# Altium project AIRZAI_LID_BD_REVB.PrjPcb
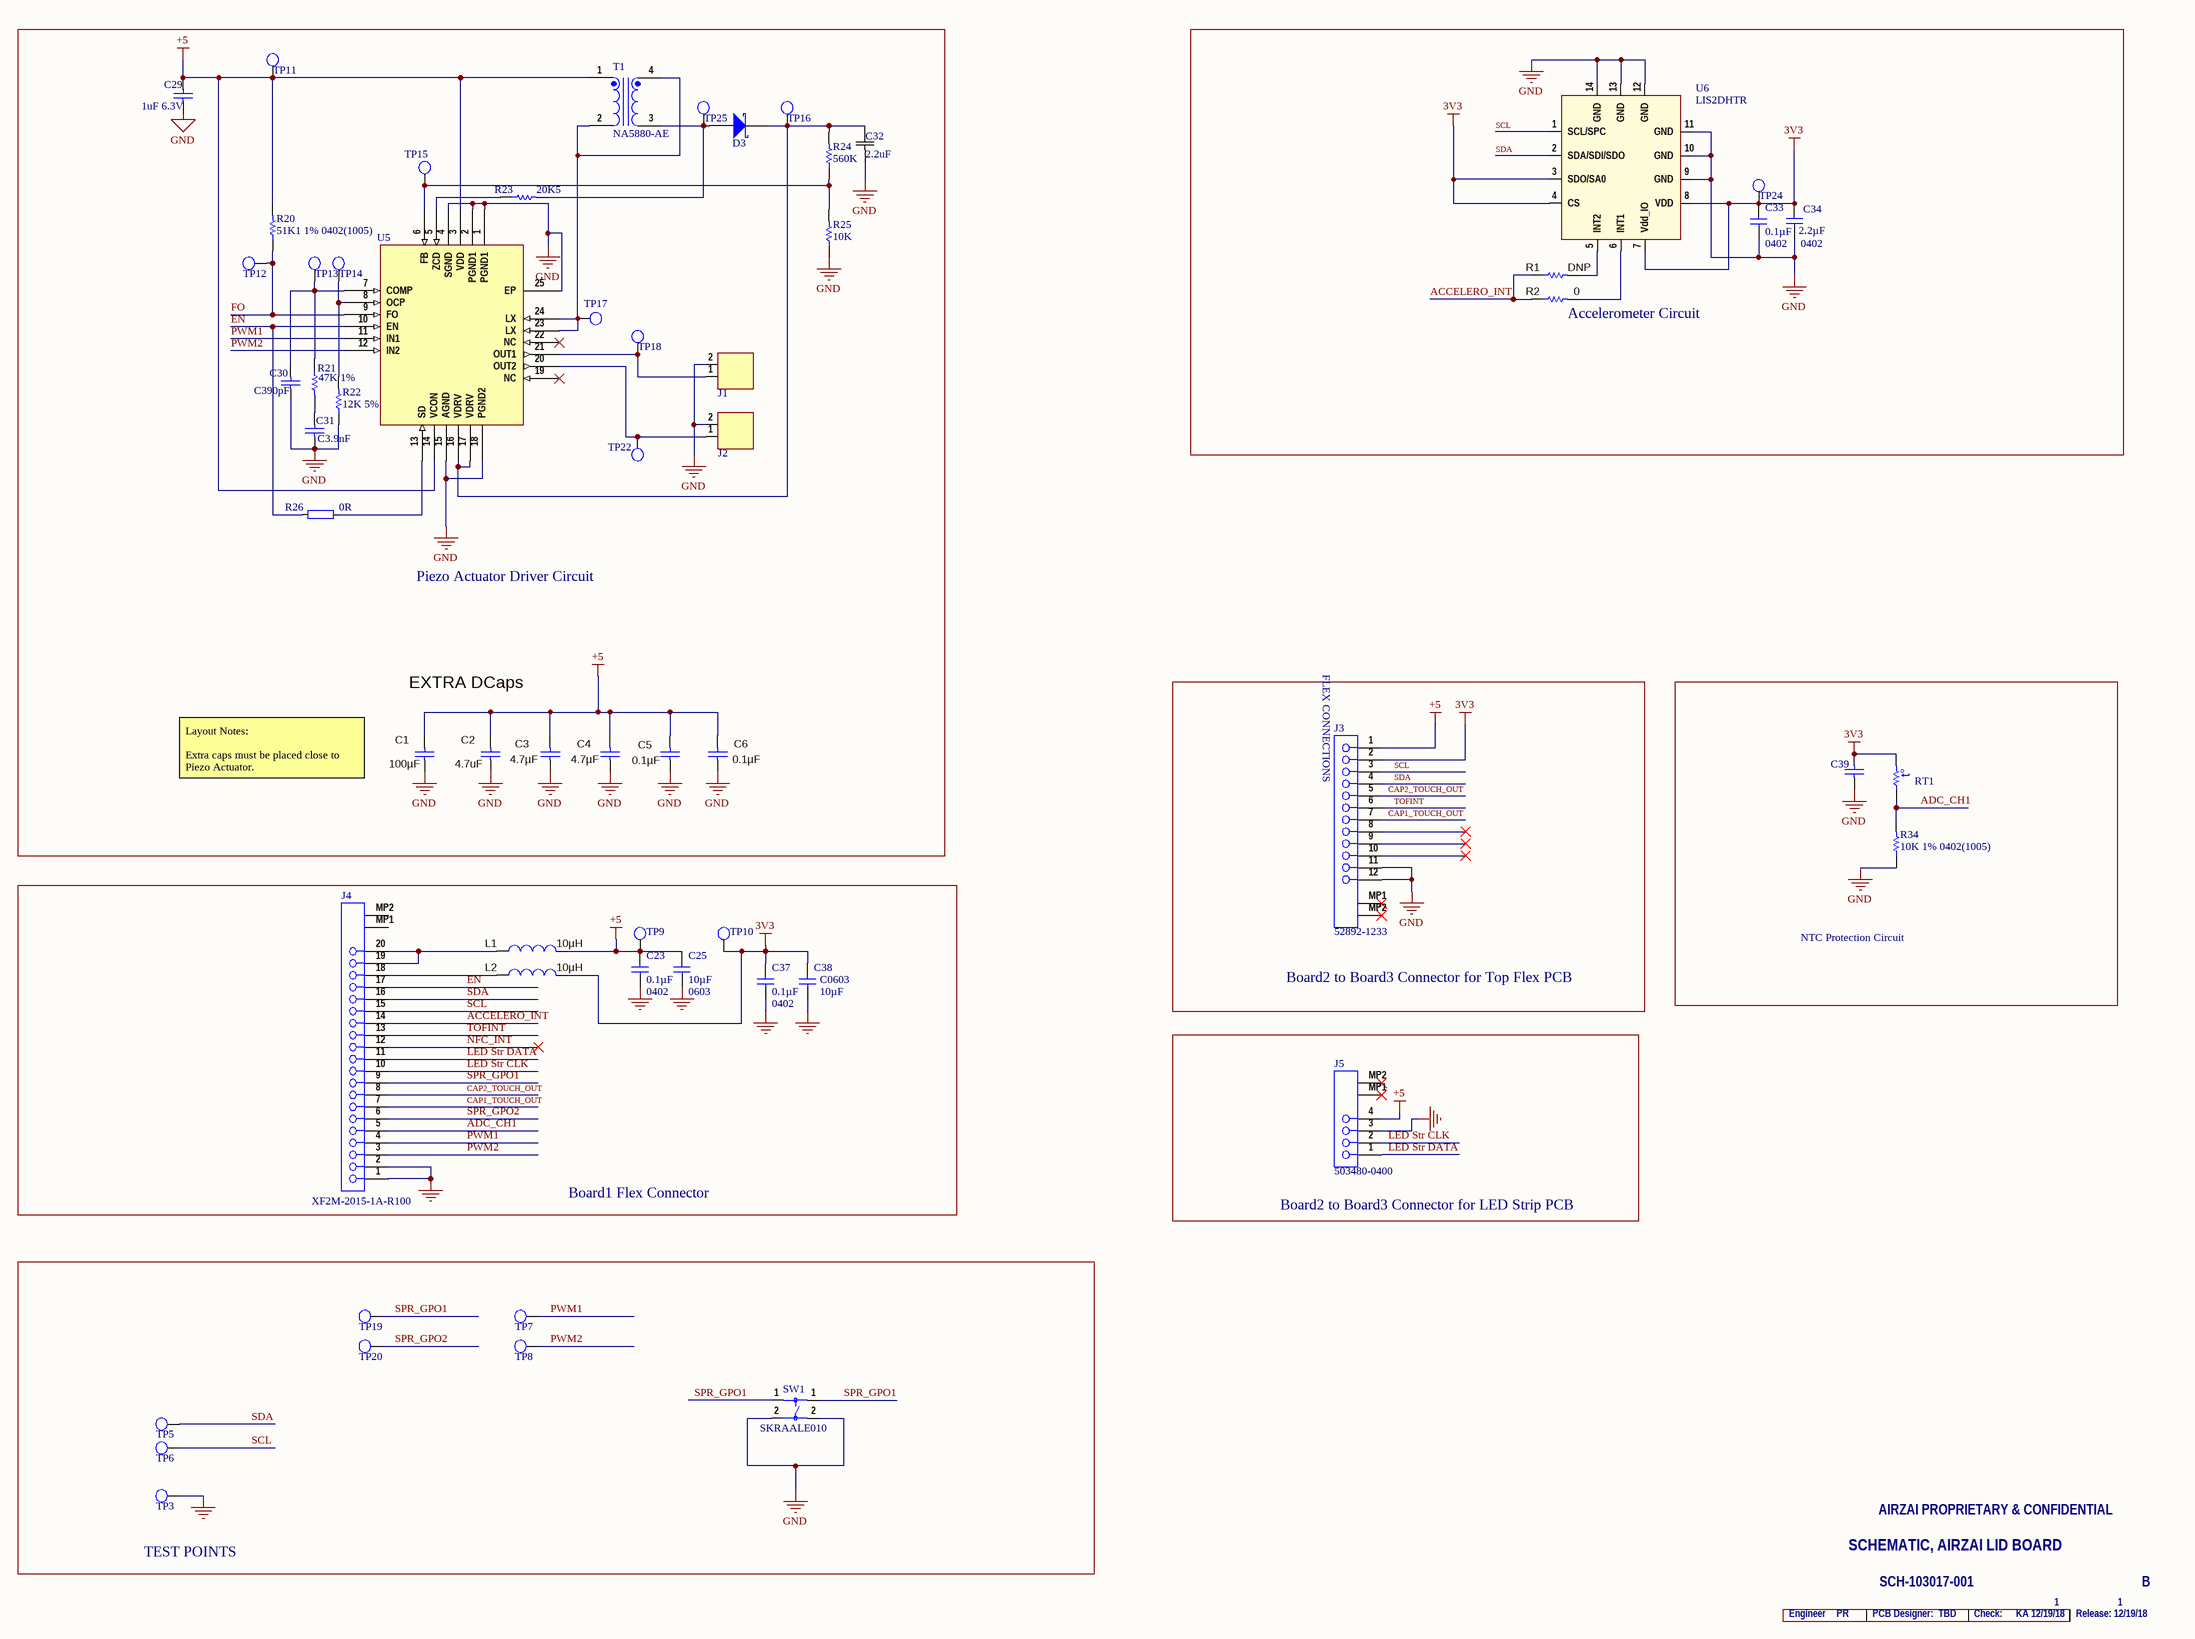
[diagram p0: AIRZAI_LID_BD_REVB Sheet1.SchDoc]
1 sheet, 60 parts. Net scope: global (net labels, ports and power ports of the same name join across sheets).
Board file: AIRZAI_LID_BD_REVB.PcbDoc

## Sheet AIRZAI_LID_BD_REVB Sheet1.SchDoc
size C

### Parts
C1  ValueDisplayed: 100µF  [1206_180]  (hidden comment: GRM31CR60J107ME39L)
C2  value 4.7uF  [SM0402_BTD.1SM_ACT_H55_CAP_WSS]  (hidden comment: C1005X5R0J475M050BC)
C3  ValueDisplayed: 4.7µF  [SM0402_BTD.1SM_ACT_H55_CAP_WSS]  (hidden comment: C1005X5R0J475M050BC)
C4  ValueDisplayed: 4.7µF  [SM0402_BTD.1SM_ACT_H55_CAP_WSS]  (hidden comment: C1005X5R0J475M050BC)
C5  ValueDisplayed: 0.1µF  [SM0402_BTD.1SM_ACT_H55_CAP_WSS]  (hidden comment: C1005X5R1A104K050BA)
C6  ValueDisplayed: 0.1µF  [SM0402_BTD.1SM_ACT_H55_CAP_WSS]  (hidden comment: C1005X5R1A104K050BA)
C23  0.1µF  Footprint: 0402  [0402CAP]
C25  10µF  Footprint: 0603  [SM0603_BTD.1SM_H90_WSS]
C29  1uF 6.3V  [CAPC0402(1005)60_M]
C30  C390pF  [CAPC0402(1005)60_M]
C31  C3.9nF  [CAPC0402(1005)60_M]
C32  2.2uF  [C1210_N]
C33  0.1µF  [0402]
C34  2.2µF  [0402]
C37  0.1µF  Footprint: 0402  [0402CAP]
C38  10µF  Footprint: C0603  [SM0603_BTD.1SM_H90_WSS]
C39  CAP 100nF 10V 0402(1005)  [CAPC0402(1005)60_M]  (value not drawn)
D3  STPS2H100A  [STM-SMA-2_V]  (value not drawn)
J1  (no value)  [CON_78171_0002]
J2  (no value)  [CON_78171_0002]
J3  52892-1233  [MOLX-52892-1233]
J4  XF2M-2015-1A-R100  [Omron_XF2M-2015-1A_0]
J5  503480-0400  [MOLX-503480-0400]
L1  ValueDisplayed: 10µH  [0805]  (hidden comment: CB2012T100KR)
L2  ValueDisplayed: 10µH  [0805]  (hidden comment: CB2012T100KR)
R1  DNP  [0402]
R2  ValueDisplayed: 0  [0402]  (hidden comment: ERJ-2GE0R00X)
R20  51K1 1% 0402(1005)  [0402]
R21  47K 1%  [0402]
R22  12K 5%  [0402]
R23  20K5  [0402]
R24  560K  [0402]
R25  10K  [0402]
R26  0R  [0402]
R34  10K 1% 0402(1005)  [0402]
RT1  NCP18XH103F03RB  [MURA-NCP18XH103F03RB-2_V]  (value not drawn)
SW1  SKRAALE010  [SW_ALPS_SKRAALE010]
T1  NA5880-AE  [Coilcraft_NA5880-AE_MFG]
TP3  TESTPOINT  [TP_0.9MM]  (value not drawn)
TP5  TESTPOINT  [TP_0.9MM]  (value not drawn)
TP6  TESTPOINT  [TP_0.9MM]  (value not drawn)
TP7  TESTPOINT  [TP_0.9MM]  (value not drawn)
TP8  TESTPOINT  [TP_0.9MM]  (value not drawn)
TP9  TESTPOINT  [TP_0.9MM]  (value not drawn)
TP10  TESTPOINT  [TP_0.9MM]  (value not drawn)
TP11  TESTPOINT  [TP_0.9MM]  (value not drawn)
TP12  TESTPOINT  [TP_0.9MM]  (value not drawn)
TP13  TESTPOINT  [TP_0.9MM]  (value not drawn)
TP14  TESTPOINT  [TP_0.9MM]  (value not drawn)
TP15  TESTPOINT  [TP_0.9MM]  (value not drawn)
TP16  TESTPOINT  [TP_0.9MM]  (value not drawn)
TP17  TESTPOINT  [TP_0.9MM]  (value not drawn)
TP18  TESTPOINT  [TP_0.9MM]  (value not drawn)
TP19  TESTPOINT  [TP_0.9MM]  (value not drawn)
TP20  TESTPOINT  [TP_0.9MM]  (value not drawn)
TP22  TESTPOINT  [TP_0.9MM]  (value not drawn)
TP24  TESTPOINT  [TP_0.9MM]  (value not drawn)
TP25  TESTPOINT  [TP_0.9MM]  (value not drawn)
U5  FAN8841MPXCT-ND  [WFQFN-24-FAN8841MPX]  (value not drawn)
U6  LIS2DHTR  [STM-LGA-14_L]

### Blocks framed on the sheet
EXTRA DCaps: C1-C6 C29-C32 D3 J1 J2 R20-R26 T1 TP11-TP18 TP22 TP25 U5
Accelerometer Circuit: C33 C34 R1 R2 TP24 U6
Board2 to Board3 Connector for Top Flex PCB: J3
NTC Protection Circuit: C39 R34 RT1
Board1 Flex Connector: C23 C25 C37 C38 J4 L1 L2 TP9 TP10
Board2 to Board3 Connector for LED Strip PCB: J5
TEST POINTS: SW1 TP3 TP5-TP8 TP19 TP20

### Nets
3V3: C33.1 C34.2 C37.1 C38.1 C39.2 J3.2 L2.2 RT1.2 TP10.1 TP24.1 U6.3(SDO/SA0) U6.4(CS) U6.7(Vdd_IO) U6.8(VDD)
+5: C1.1 C2.1 C3.1 C4.1 C5.1 C6.1 C23.1 C25.1 C29.2 J3.1 J5.4 L1.2 R20.2 T1.1 TP9.1 TP11.1 U5.3(VDD) U5.14(VCON)
GND: C1.2 C2.2 C3.2 C4.2 C5.2 C6.2 C23.2 C25.2 C29.1 C30.2 C31.1 C32.1 C33.2 C34.1 C37.2 C38.2 C39.1 J1.2 J2.2 J3.11 J3.12 J4.1 J4.2 J5.3 R22.1 R25.1 R34.1 SW1.2 TP3.1 U5.1(PGND1) U5.2(PGND1) U5.4(SGND) U5.15(AGND) U5.18(PGND2) U5.25(EP) U6.9(GND) U6.10(GND) U6.11(GND) U6.12(GND) U6.13(GND) U6.14(GND)
ACCELERO_INT: J4.14 R1.1 R2.1
ADC_CH1: J4.5 R34.2 RT1.1
CAP1_TOUCH_OUT: J3.7 J4.7
CAP2_TOUCH_OUT: J3.5 J4.8
EN: J4.17 R26.2 U5.10(EN)
FO: R20.1 TP12.1 U5.9(FO)
LED Str CLK: J4.10 J5.2
LED Str DATA: J4.11 J5.1
NFC_INT: J4.12
PWM1: J4.4 TP7.1 U5.11(IN1)
PWM2: J4.3 TP8.1 U5.12(IN2)
SCL: J3.3 J4.15 TP6.1 U6.1(SCL/SPC)
SDA: J3.4 J4.16 TP5.1 U6.2(SDA/SDI/SDO)
SPR_GPO1: J4.9 SW1.1 TP19.1
SPR_GPO2: J4.6 TP20.1
TOFINT: J3.6 J4.13
NetC30_1: C30.1 R21.1 TP13.1 U5.7(COMP)
NetC31_2: C31.2 R21.2
NetC32_2: C32.2 D3.2(K) R24.2 TP16.1 U5.16(VDRV) U5.17(VDRV)
NetD3_1: D3.1(A) R23.2 T1.3 TP25.1
NetJ1_1: J1.1 TP18.1 U5.21(OUT1)
NetJ2_1: J2.1 TP22.1 U5.20(OUT2)
NetJ4_18: J4.18 L2.1
NetJ4_19: J4.19 J4.20 L1.1
NetR1_2: R1.2 U6.5(INT2)
NetR2_2: R2.2 U6.6(INT1)
NetR22_2: R22.2 TP14.1 U5.8(OCP)
NetR23_1: R23.1 U5.5(ZCD)
NetR24_1: R24.1 R25.2 TP15.1 U5.6(FB)
NetR26_1: R26.1 U5.13(SD)
NetT1_2: T1.2 T1.4 TP17.1 U5.23(LX) U5.24(LX)

Not connected (* = marked no-connect by the designer): J3 8* 9* 10* MP1* MP2*; J4 MP1 MP2; J5 MP1* MP2*; U5 19(NC)* 22(NC)*

### Notes on the sheet
- Piezo Actuator Driver Circuit
- Layout Notes:
  Extra caps must be placed close to Piezo Actuator.
- (near J3) FLEX CONNECTIONS
- SCHEMATIC, AIRZAI LID BOARD
- AIRZAI PROPRIETARY & CONFIDENTIAL
- Engineer
- PR
- PCB Designer:
- SCH-103017-001
- TBD
- Check:
- KA 12/19/18
- 1
- Release: 12/19/18
- B
- (in symbol MURA-NCP18XH103F03RB-2) t°

### Library data of the parts
C1 = GRM31CR60J107ME39L: CAP, CERM, 100 µF, 6.3 V, +/- 20%, X5R, 1206; Manufacturer: MuRata; Polarized: N; CompType: Capacitor; Value: 100uF; U/M: EA; Cap_F: 0.0001; Tolerance_%: 20; ESR_ohm: 0.003; Value1: 0.003 ohm; VDC_V: 6.3; Value2: 6.3V; TaMin_C: -55; TaMax_C: 85; Cap_Case: 1206; SizeArea_mm2: 5.12; SizeAreaWB_mm2: 10.92; SizeX_mm: 3.2; SizeY_mm: 1.6; SizeZ_mm: 1.8; AEC Category: Q200; SymbolVersion: 2008-07-09; PartNumber: GRM31CR60J107ME39L; PackageReference: 1206; RoHS: Y; MountType: SMT; Technology: Ceramic; TempCo: X5R; Published: 2008-06-19; Publisher: Texas Instruments; LatestRevisionDate: 2016-07-02; ComponentLink1Description: Datasheet link; ComponentLink1URL: http://search.murata.co.jp/Ceramy/PnsearchViewAction.do?HnOFG=ON&HnNFG=ON&SEL_CNT=50&sLang=en&sKey=GRM31CR60J107ME39L&x=9&y=9&search=startwith; Supplier 1: Digi-Key; Supplier Part Number 1: 490-4539-1-ND; Supplier 2: Mouser; Supplier Part Number 2: 81-GRM31CR60J107ME9L; Supplier 3: Farnell; Supplier Part Number 3: 1735535; AEC Qualified: ?
C2 = C1005X5R0J475M050BC: CAP, CERM, 4.7 µF, 6.3 V, +/- 20%, X5R, 0402; Manufacturer: TDK; PartNumber: C1005X5R0J475M050BC
C3 C4 = C1005X5R0J475M050BC: CAP, CERM, 4.7 µF, 6.3 V, +/- 20%, X5R, 0402; Manufacturer: TDK; Polarized: N; CompType: Capacitor; Value: 4.7uF; U/M: EA; Cap_F: 0.0000047; Tolerance_%: 20; Value1: Unknown; VDC_V: 6.3; Value2: 6.3V; TaMin_C: -55; TaMax_C: 85; Cap_Case: 0402; SymbolVersion: 2008-07-09; PartNumber: C1005X5R0J475M050BC; PackageReference: 0402; RoHS: Y; MountType: SMT; Technology: Ceramic; TempCo: X5R; Published: 2008-06-19; Publisher: Texas Instruments; LatestRevisionDate: 2015-02-23; ComponentLink1Description: Datasheet link; ComponentLink1URL: http://www.tdk.com/pdf/TDKMLCCCapRange.pdf; Supplier 1: Digi-Key; Supplier Part Number 1: 445-7395-1-ND; Supplier 2: Farnell; Supplier Part Number 2: 1962109; Supplier 3: Newark; Supplier Part Number 3: 48T2906
C5 = C1005X5R1A104K050BA: CAP, CERM, 0.1 µF, 10 V, +/- 10%, X5R, 0402; Manufacturer: TDK; Polarized: N; CompType: Capacitor; Value: 0.1uF; U/M: EA; Cap_F: 0.0000001; Tolerance_%: 10; Value1: Unknown; Value2: 10V; TaMin_C: -55; TaMax_C: 85; Cap_Case: 0402; SymbolVersion: 2008-07-09; PartNumber: C1005X5R1A104K050BA; PackageReference: 0402; RoHS: Y; VDC_V: 10; MountType: SMT; Technology: Ceramic; TempCo: X5R; Published: 2008-06-19; Publisher: Texas Instruments; LatestRevisionDate: 2015-02-23; ComponentLink1Description: Datasheet link; ComponentLink1URL: http://product.tdk.com/en/catalog/datasheets/mlcc_commercial_general_en.pdf; Supplier 1: Digi-Key; Supplier Part Number 1: 445-1265-1-ND; Supplier 2: Mouser; Supplier Part Number 2: 810-C1005X5R1A104K; Supplier 3: Farnell; Supplier Part Number 3: 2368215
C6 = C1005X5R1A104K050BA: CAP, CERM, 0.1 µF, 10 V, +/- 10%, X5R, 0402; Manufacturer: TDK; Polarized: N; CompType: Capacitor; Value: 0.1uF; U/M: EA; Cap_F: 0.0000001; Tolerance_%: 10; Value1: Unknown; Value2: 10V; TaMin_C: -55; TaMax_C: 85; Cap_Case: SM0402_BTD.1SM_ACT; SymbolVersion: 2008-07-09; PartNumber: C1005X5R1A104K050BA; PackageReference: 0402; RoHS: Y; VDC_V: 10; MountType: SMT; Technology: Ceramic; TempCo: X5R; Published: 2008-06-19; Publisher: Texas Instruments; LatestRevisionDate: 2015-02-23; ComponentLink1Description: Datasheet link; ComponentLink1URL: http://product.tdk.com/en/catalog/datasheets/mlcc_commercial_general_en.pdf; Supplier 1: Digi-Key; Supplier Part Number 1: 445-1265-1-ND; Supplier 2: Mouser; Supplier Part Number 2: 810-C1005X5R1A104K; Supplier 3: Farnell; Supplier Part Number 3: 2368215
C23 C33 = C0402-100n: Capacitor, X7R, ±10%; Manufacturer: TDK; Manufacturer Part Number: C1005X7R1C104K; Note: 16V ±10% X7R; Case-Metric: 1005; Rated Voltage: 16 V; Tolerance: Â±10%; Datasheet: *; Pin Count: 2; Value: 0.1µF; Supplier: *; Supplier part number: *; 2nd source Supplier: *; 2nd source part number: *; Case-EIA: 0402; Supplier 1: Digi-Key; Supplier Part Number 1: 445-4952-2-ND; Technology: SMT
  C23: Max Thickness: 0.6mm
  C33: Max Thickness: 0.6 mm
C25 = C0402-100n: 6.3volts X5R 20%; Manufacturer: MURATA; Manufacturer Part Number: GRM188R60J106ME47D; Case-Metric: 1608; Rated Voltage: 6.3 V; Tolerance: Â±10%; Value: 10µF; Note: 6.3volts X5R 20%; Supplier 1: Digi-Key; Supplier Part Number 1: 490-3896-6-ND; Case-EIA: 0603; Max Thickness: 0.9 mm; Technology: SMT
C29 = CAP: CAP 1uF 6.3V ±10% 0402 (1005 Metric) Thickness 0.6mm SMD; Manufacturer: MURATA; Manufacturer Part Number: GRM155R61A105KE15D; Case-Metric: 1005; Case-EIA: 0402; Tolerance: Â±10%; Rated Voltage: 10 V; Value: 1uF; Technology: SMT; Max Thickness: 0.6 mm; Supplier 1: Digi-Key; Supplier Part Number 1: 490-3890-6-ND
C30 = CAP: CAP 390pF 50V ±20% 0402 (1005 Metric) Thickness 0.6mm SMD; Manufacturer: KEMET; Manufacturer Part Number: C0402C391K5RACTU; Case-EIA: 0402; Tolerance: Â±20%; Case-Metric: 1005; Rated Voltage: 50 V; Value: 390pF; Max Thickness: 0.6 mm; Technology: SMT; Supplier 1: Digi-Key; Supplier Part Number 1: 399-7792-6-ND
C31 = CAP: CAP 3.9nF 50V ±10% 0402 (1005 Metric) Thickness 0.6mm SMD; Manufacturer: TDK; Manufacturer Part Number: C2012C0G1H392J060AA; Case-Metric: 1005; Case-EIA: 0402; Tolerance: Â±10%; Max Thickness: 0.6 mm; Rated Voltage: 50 V; Technology: SMT; Value: 3.9nF; Supplier 1: Digi-Key; Supplier Part Number 1: 445-7510-1-ND
C32 = C3225JB2A225K230: Imported; Manufacturer_Part_Number: C3225JB2A225K230AB; Vendor: TDK; Built_By: EMA_UL_Team; Type: DEV; Value: 2.2µF; C: Copyright (C) 2015 Accelerated Designs. All rights reserved; Case-EIA: 1210; Case-Metric: 3225; Rated Voltage: 100 V; Tolerance: Â±10%; RefDes: RefDes; Manufacturer: TDK; Manufacturer Part Number: C3225JB2A225K230AB; Max Thickness: *; Supplier 1: Digi-Key; Supplier Part Number 1: 445-11868-2-ND; Technology: SMT
C34 = C0603-1µ0 X7R: Capacitor, X7R, ±10%; Manufacturer: TDK; Manufacturer Part Number: C1005X5R0J225M; Note: 6.3V ±20% X5R; Case-Metric: 1005; Rated Voltage: 6.3 V; Tolerance: Â±10%; Value: 2.2µF; Case-EIA: 0402; Max Thickness: 0.6 mm; Supplier 1: Digi-Key; Supplier Part Number 1: 445-4999-2-ND; Technology: SMT
C37 = C0402-100n: Capacitor, X7R, ±10%; Manufacturer: TDK; Manufacturer Part Number: C1005X7R1C104K; Note: 16V ±10% X7R; Case-Metric: 1005; Rated Voltage: 16 V; Datasheet: *; Pin Count: 2; Value: 0.1µF; Supplier: *; Supplier part number: *; 2nd source Supplier: *; 2nd source part number: *; Case-EIA: 0402; Max Thickness: 0.6 mm; Supplier 1: Digi-Key; Supplier Part Number 1: 445-4952-2-ND; Technology: SMT; Tolerance: ±10%
C38 = C0402-100n: Capacitor, X7R, ±10%; Manufacturer: MURATA; Manufacturer Part Number: GRM188R60J106ME47D; Note: 6.3volts X5R 20%; Case-EIA: 0603; Case-Metric: 1608; Rated Voltage: 6.3 V; Value: 10µF; Max Thickness: 0.9 mm; Supplier 1: Digi-Key; Supplier Part Number 1: 490-3896-6-ND; Technology: SMT; Tolerance: ±10%
C39 = CAP: CAP 100nF 10V ±10% 0402 (1005 Metric) Thickness 0.6mm SMD; Manufacturer: Yageo; Manufacturer Part Number: CC0402ZRY5V8BB104; Case-EIA: 0402; Case-Metric: 1005; Tolerance: Â±10%; Rated Voltage: 25 V; Max Thickness: 0.6 mm; Value: 100nF; Technology: SMT; Supplier 1: Digi-Key; Supplier Part Number 1: 311-1375-6-ND
D3 = DSKY-AK-2: Power Schottky Rectifier, 2 A, 100 V, 2-Pin SMD (SMA), RoHS, Tape and Reel; Manufacturer: STMicroelectronics; Other Related Documents: STPS2H100ViewAllSpecifications; Voltage - Forward (Vf) (Max) @ If: 790mV@2A; Current - Average Rectified (Io): 2A; Online Catalog: SchottkyDiode; Voltage - DC Reverse (Vr) (Max): 100V; Other Names: 497-3758-6; Speed: FastRecovery=200mA(Io); Current - Reverse Leakage @ Vr: 1µA@100V; Case-EIA: DO-214AC, SMA; Rated Voltage: 100 V; Value: 100V 2A; Series: -; Datasheet Version: 06/2013; Manufacturer URL: http://www.st.com/; Diode Type: Schottky; Standard Package: 1; Package URL: http://www.st.com/st-web-ui/static/active/en/resource/technical/document/datasheet/CD00283518.pdf; Category: DiscreteSemiconductorProducts; Operating Temperature - Junction: 175°C(Max); Package / Case: DO-214AC,SMA; Package Description: 2-Pin Surface Mount Device, Body 4.275 x 2.575 mm; Mounting Type: SurfaceMount; Family: Diodes,Rectifiers-Single; Reverse Recovery Time (trr): -; Package Reference: SMA; Mounting Technology: SurfaceMount; Packaging: Digi-Reel®; Capacitance @ Vr, F: -; Supplier Device Package: SMA(DO-214AC); Datasheet URL: http://www.st.com/content/ccc/resource/technical/document/datasheet/0a/8b/df/ef/15/72/4f/38/CD00001548.pdf/files/CD00001548.pdf/jcr:content/translations/en.CD00001548.pdf; Manufacturer Part Number: STPS2H100A; Supplier 1: Digi-Key; Supplier Part Number 1: 497-3758-6-ND; Technology: SMT
J1 J2 = CONN_BM02B_SURS_TF: Manufacturer Part Number: 781710002; Manufacturer: MOLEX; Supplier 1: Digi-Key; Supplier Part Number 1: WM4459TR-ND; Technology: SMT
J3 = MOLX-52892-1233: 0.5 mm Pitch Easy-On(TM) Type FPC Connector, 2.0 mm Mated Height, Right Angle, ZIF, SMT, Bottom Contact, 12 Circuits, -40 to 85 degC, ELV and RoHS Compliant, Tape and Reel; Manufacturer: MOLEX; Manufacturer Part Number: 0528921233; Circuits (Loaded): 12; Material - Plating Mating: Silver, Tin-Bismuth; Voltage (Max): 50V; Durability (mating cycles max): 20; Polarized to PCB: No; Mated Height: 2.00mm; Current (Max per Contact): 0.5A; PCB Retention: Yes; Pitch - Mating Interface: 0.50mm; Material - Metal: Phosphor Bronze; Entry Angle: 90degrees Angle; ComponentLink2URL: http://www.molex.com/webdocs/datasheets/pdf/en-us/0528921233_FFC_FPC_CONNECTORS.pdf; Number of Rows: 1; Mounting Technology: Surface Mount; ComponentLink1URL: http://www.molex.com/molex/index.jsp; ComponentLink3URL: http://www.molex.com/pdm_docs/sd/528921233_sd.pdf; ComponentLink1Description: Manufacturer URL; ComponentLink2Description: Datasheet; Contact Position: Bottom; PartNumber: 52892-1233; PackageVersion: Rev. A, 05/2013; Orientation: Right Angle; Packing: Tape and Reel; PackageReference: 52892-1233; RoHS: TRUE; Stackable: No; Material - Plating Termination: Silver, Tin-Bismuth; PCB Locator: No; Pitch - Termination Interface: 0.50mm; ComponentLink3Description: Package Specification; PackageDescription: 12-Lead FPC Connector, Pitch 0.5 mm; Max Thickness: 0.6 mm; Supplier 1: Digi-Key; Supplier Part Number 1: WM11084TR-ND; Technology: SMT
J4 = XF2M-2015-1A-R100: Manufacturer: OMRON ELECTRONIC COMPONENTS; ComponentLink1URL: http://www.molex.com/molex/index.jsp; ComponentLink2URL: http://www.molex.com/webdocs/datasheets/pdf/en-us/0528922033_FFC_FPC_CONNECTORS.pdf; ComponentLink3Description: Package Specification; ComponentLink3URL: http://www.molex.com/pdm_docs/sd/528922033_sd.pdf; ComponentLink1Description: Manufacturer URL; Supplier 1: Digikey; Supplier Part Number 1: Z5253-ND; Manufacturer Part Number: XF2M-2015-1A-R100; Stock 1: 0
J5 = 503480-0400: 0.5 mm Pitch Easy-On(TM) BackFlip(TM) Type FPC Connector, 1.0 mm Mated Height, Right Angle, SMT, Dual Contact, 4 Circuits, -40 to 85 degC, ELV and RoHS Compliant, Tape and Reel; Manufacturer: Molex; Durability (mating cycles max): 10; Mated Height: 1.00mm; Material - Metal: Phosphor Bronze; Polarized to PCB: Yes; Voltage (Max): 50V AC (RMS)/DC; PCB Locator: No; Entry Angle: 90degrees Angle; Material - Plating Termination: Gold, Tin; Current (Max per Contact): 0.5A; Material - Plating Mating: Gold; Pitch - Mating Interface: 0.50mm; Circuits (Loaded): 4; Contact Position: Dual; PartNumber: 503480-0400; ComponentLink1Description: Manufacturer URL; ComponentLink2Description: Datasheet; ComponentLink3URL: http://www.molex.com/pdm_docs/sd/5034800400_sd.pdf; ComponentLink3Description: Package Specification; ComponentLink1URL: http://www.molex.com/molex/index.jsp; Packing: Tape and Reel; Number of Rows: 1; ComponentLink2URL: http://www.molex.com/webdocs/datasheets/pdf/en-us/5034800400_FFC_FPC_CONNECTORS.pdf; PackageReference: 503480-0400; PackageVersion: Rev. F, 09/2012; RoHS: TRUE; PCB Retention: Yes; Orientation: Right Angle; Stackable: No; Mounting Technology: Surface Mount; PackageDescription: 4-Lead FPC Connector, Pitch 0.5 mm
L1 L2 = CB2012T100KR: Inductor, 10 µH, 0.5A, 0.65 ohm, SMD; Manufacturer: Taiyo Yuden; Value: 10uH; Core Material: Ferrite; Current Rating: 520mA; Saturation Current: 200mA; Tolerance: 10%; Shielding: Unshielded; Self Resonant Frequency: 32MHz; DC Resistance (DCR): 500mR; Test Frequency: 2.52MHz; PartNumber: CB2012T100KR; Value1: 0.65 ohm; Value2: 0.5A; Technology: Wirewound; ComponentLink1Description: Datasheet link; ComponentLink1URL: http://www.yuden.co.jp/ut/product/category/inductor/BRC2012T2R2MD.pdf; Supplier 1: Digi-Key; Manufacturer Part Number: CB2012T100KR; Stock 1: 18059; Pricing 1: 1 = 0.23000, 10 = 0.20700, 100 = 0.14230, 500 = 0.12162, 1000 = 0.09315 (USD); RoHS: Yes; Mount: Surface Mount; Case/Package: 0805; Number of Pins: 2; Case Code (Metric): 2012; Case Code (Imperial): 0805; Min Operating Temperature: -40°C; Max Operating Temperature: 105°C; Package Quantity: 3000; Packaging: Tape and Reel; Inductance Tolerance: 10%; Composition: Wirewound; Inductance: 10uH; Max DC Current: 200mA; Termination: SMD/SMT; Length: 0.079inch; Height: 1.25mm; Width: 0.049inch; Height - Seated (Max): 0.057inch; REACH SVHC: Unknown; Lead Free: Lead Free; Halogen Free: Halogen Free; ComponentLink2URL: https://datasheet.ciiva.com/1040/cb2012t100kr-ss-1040384.pdf?src-supplier=Digi-Key; ComponentLink2Description: https://datasheet.ciiva.com/1040/cb2012t100kr-ss-1040384.pdf?src-supplier=Digi-Key; Supplier Part Number 1: 587-2452-1-ND
R1 = ERJ-2GE0R00X: RES, DNP, 0402; Value: DNP; ComponentLink1Description: Datasheet link; ComponentLink1URL: http://www.panasonic.com/industrial/components/pdf/AOA0000CE1.pdf
R2 = ERJ-2GE0R00X: RES, 0, 5%, 0.063 W, 0402; Manufacturer: Panasonic; CompType: Resistor; Value: 0; Value_Code: 0000; Tolerance_%: 5; Power_W: 0.063; Value2: 0.063W; VDC_V: 50; TempCo: 600 ppm/C; EIA_Code: E24; U/M: EA; SizeArea_mm2: 0.5; SizeX_mm: 1; SizeZ_mm: 0.6; AEC Category: Q200; SymbolVersion: 2009-05-29; PartNumber: ERJ-2GE0R00X; PackageReference: 0402; RoHS: Y; Res_ohm: 0; Value1: 5%; MountType: SMT; Technology: Thick Film; Published: 2008-06-26; Publisher: Texas Instruments; LatestRevisionDate: 2016-07-01; ComponentLink1Description: Datasheet link; ComponentLink1URL: http://www.panasonic.com/industrial/components/pdf/AOA0000CE1.pdf; Supplier 1: Digi-Key; Supplier Part Number 1: P0.0JCT-ND; Supplier 2: Mouser; Supplier Part Number 2: 667-ERJ-2GE0R00X; Supplier 3: Farnell; Supplier Part Number 3: 2059190; SizeY_mm: 0.5; AEC Qualified: ?
R20 = RES: 51K1 0.063W 1% 0402 (1005 Metric)  SMD; Manufacturer: Vishay Dale; Manufacturer Part Number: CRCW040251K1FKED; Case-Metric: 1005; Value: 51100.00 Ohm; Case-EIA: 0402; Power: 0.063 W; Tolerance: 1 %; Technology: SMT; Supplier 1: Digi-Key; Supplier Part Number 1: 541-51.1KLDKR-ND; Max Thickness: 0.6 mm
R21 = RES: 47K 0.063W 1% 0402 (1005 Metric)  SMD; Manufacturer: panasonic; Manufacturer Part Number: ERJ-2RKF4702X; Case-Metric: 1005; Value: 47000.00 Ohm; Case-EIA: 0402; Power: 0.063 W; Technology: SMT; Tolerance: 1 %; Supplier 1: Digi-Key; Supplier Part Number 1: P47.0KLTR-ND; Max Thickness: 0.6 mm
R22 = RES: 12K 0.063W 5% 0402 (1005 Metric)  SMD; Manufacturer: Yageo; Manufacturer Part Number: RC0402JR-0712KL; Case-Metric: 1005; Value: 12000.00 Ohm; Technology: SMT; Tolerance: 5 %; Power: 0.063 W; Case-EIA: 0402; Supplier 1: Digi-Key; Supplier Part Number 1: 311-12KJRTR-ND; Max Thickness: 0.6 mm
R23 = RES: 20K5 0.063W 1% 0402 (1005 Metric)  SMD; Manufacturer: Vishay Dale; Manufacturer Part Number: CRCW040220K5FKED; Case-Metric: 1005; Value: 20500.00 Ohm; Power: 0.063 W; Technology: SMT; Case-EIA: 0402; Tolerance: 1 %; Supplier 1: Digi-Key; Supplier Part Number 1: 541-20.5KLDKR-ND; Max Thickness: 0.6 mm
R24 = RES: 560K 0.063W 1% 0402 (1005 Metric)  SMD; Manufacturer: Vishay Dale; Manufacturer Part Number: CRCW0402560KFKED; Value: 560000.00 Ohm; Case-Metric: 1005; Case-EIA: 0402; Technology: SMT; Power: 0.063 W; Tolerance: 1 %; Supplier 1: Digi-Key; Supplier Part Number 1: 541-560KLDKR-ND; Max Thickness: 0.6 mm
R25 = RES: 10K 0.063W 5% 0402 (1005 Metric)  SMD; Manufacturer: Vishay Dale; Manufacturer Part Number: CRCW040210K0JNED; Case-Metric: 1005; Value: 10000.00 Ohm; Technology: SMT; Tolerance: 5 %; Power: 0.063 W; Case-EIA: 0402; Supplier 1: Digi-Key; Supplier Part Number 1: 541-10KJCT-ND; Max Thickness: 0.6 mm
R26 = R0402-12k: Resistor, ±1%, 0.063W; Manufacturer: Panasonic; Manufacturer Part Number: ERJ-2GE0R00X; Note: 0.1W JUMPER; Case-Metric: 1005; Tolerance: 5 %; Datasheet: *; Pin Count: 2; Value: 0R; 2nd source Supplier: *; 2nd source part number: *; Case-EIA: 0402; Max Thickness: 0.6 mm; Supplier 1: Digi-Key; Supplier Part Number 1: P0.0JTR-ND; Technology: SMT
R34 = RES: 10K 0.063W 1% 0402 (1005 Metric)  SMD; Manufacturer: Susumu; Manufacturer Part Number: RR0510P-103-D; Case-Metric: 1005; Value: 10000.00 Ohm; Case-EIA: 0402; Tolerance: 1 %; Technology: SMT; Power: 0.063 W; Max Thickness: 0.6 mm; Supplier 1: Digi-Key; Supplier Part Number 1: RR05P10.0KDTR-ND
RT1 = MURA-NCP18XH103F03RB-2: NTC Thermistor, 10 KOhm, +/- 1%, 0.1 W, -40 to 125 degC, 0603 (1608 Metric), RoHS, Tape and Reel; Manufacturer: Murata; B-constant: 3434K; Resistance: 10kO; Rated Current: 310A; Case-EIA: 0603; Case-Metric: 1608; Value: 3455K; Datasheet URL: http://www.jameco.com/Jameco/Products/ProdDS/1870999.pdf; Datasheet Version: Apr-05; Temperature Range: -40to+125degC; Tolerance (%): ±1%; Manufacturer URL: http://www.murata.com/; Type: NTC; Manufacturer Part Number: NCP18XH103F03RB; Max Thickness: 0.6 mm; Supplier 1: Digi-Key; Supplier Part Number 1: 490-4800-2-ND; Technology: SMT; Tolerance: 1 %
SW1 = SW_SKRAALE010: Manufacturer: ALPS; Manufacturer Part Number: SKRAAKE010; Value: SKRAALE010
T1 = TRANS-DOT-1-1-4: Power Inductor and Transformer, 9.6 / 38.42 uH, +/- 20%, 3.4 / 1.7 A, -40 to 85 degC, 4-Pin SMD, RoHS, Tape and Reel; Manufacturer: CoilCraft; Maximum DC Resistance: 19mOhms; Maximum DC Current: 1.3A; Type: InductorsandTransformers; Unit Weight: 0.112000oz; Core Material: AmorphousMetal; Inductance - Parallel: 3.3uH; Case-EIA: 3.9mmx3.9mm; Value: 3.3uH; Datasheet Version: 03/2007; Mounting Style: SMD/SMT; Datasheet URL: https://www.coilcraft.com/pdfs/na5880.pdf; Operating Temperature Range: -40Cto+85C; Product: PowerInductors; Packaging: Reel; Width: 13.97mm; Series: CTX4,4P,4A; Termination Style: SMD/SMT; Length: 13.97mm; Height: 6.35mm; Tradename: OCTA-PAC; Product Category: CoupledInductors; Brand: CoilCraft; Mounting Technology: SurfaceMount; RoHS: True; Manufacturer URL: www.coilcraft.com; Package Description: 4-Pin Surface Mount Device, Body 11.43 x 11.43 mm; Tolerance: 20%; Inductance - Series: 3.3uH; Manufacturer Part Number: NA5880-AE; Max Thickness: 1.1mm; Supplier 1: CoilCraft; Supplier Part Number 1: NA5880-AE
U5 = FAN8841MPXCT-ND: IC PIEZO ACTUATOR DVR 24MLP; Manufacturer: ON Semiconductor; Case-EIA: 24-WFQFN; Supplier 1: Digi-Key; Supplier Part Number 1: FAN8841MPXCT-ND; Manufacturer Part Number: FAN8841MPX; Technology: SMT; Value: FAN8841MPX
U6 = LIS2DH: Manufacturer: ST; Case-EIA: 14-VFLGA; Footprint: LGA14_2X2X1; Manufacturer Part Number: LIS2DHTR; Value: LIS2DHTR; Supplier 1: Digi-Key; Supplier Part Number 1: 497-13795-2-ND; Technology: SMT